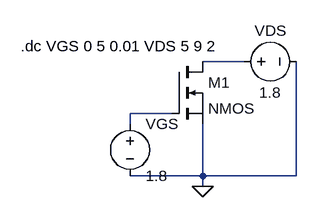
[diagram p0: schematic Draft1.asc]
Draft1.asc, the LTspice schematic file:
Version 4.1
SHEET 1 880 680
WIRE 240 96 176 96
WIRE 128 176 64 176
WIRE 64 192 64 176
WIRE 176 272 176 192
WIRE 176 272 64 272
WIRE 320 272 320 96
WIRE 320 272 176 272
WIRE 176 288 176 272
FLAG 176 288 0
SYMBOL nmos 128 96 R0
SYMATTR InstName M1
SYMBOL voltage 64 176 R0
WINDOW 123 0 0 Left 0
WINDOW 39 0 0 Left 0
SYMATTR InstName VGS
SYMATTR Value 1.8
SYMBOL voltage 224 96 R270
WINDOW 0 32 56 VTop 2
WINDOW 3 -32 56 VBottom 2
WINDOW 123 0 0 Left 0
WINDOW 39 0 0 Left 0
SYMATTR InstName VDS
SYMATTR Value 1.8
TEXT -104 72 Left 2 !.dc VGS 0 5 0.01 VDS 5 9 2

The netlist it stands for:
* Draft1.asc
M1 N001 N002 0 0 NMOS
VGS N002 0 1.8
VDS N001 0 1.8
.model NMOS NMOS
.model PMOS PMOS
.lib standard.mos
.dc VGS 0 5 0.01 VDS 5 9 2
.backanno
.end